# EAGLE design ultra-violet-tooth-sensor-mk-3.2 (EAGLE 6.5.0)
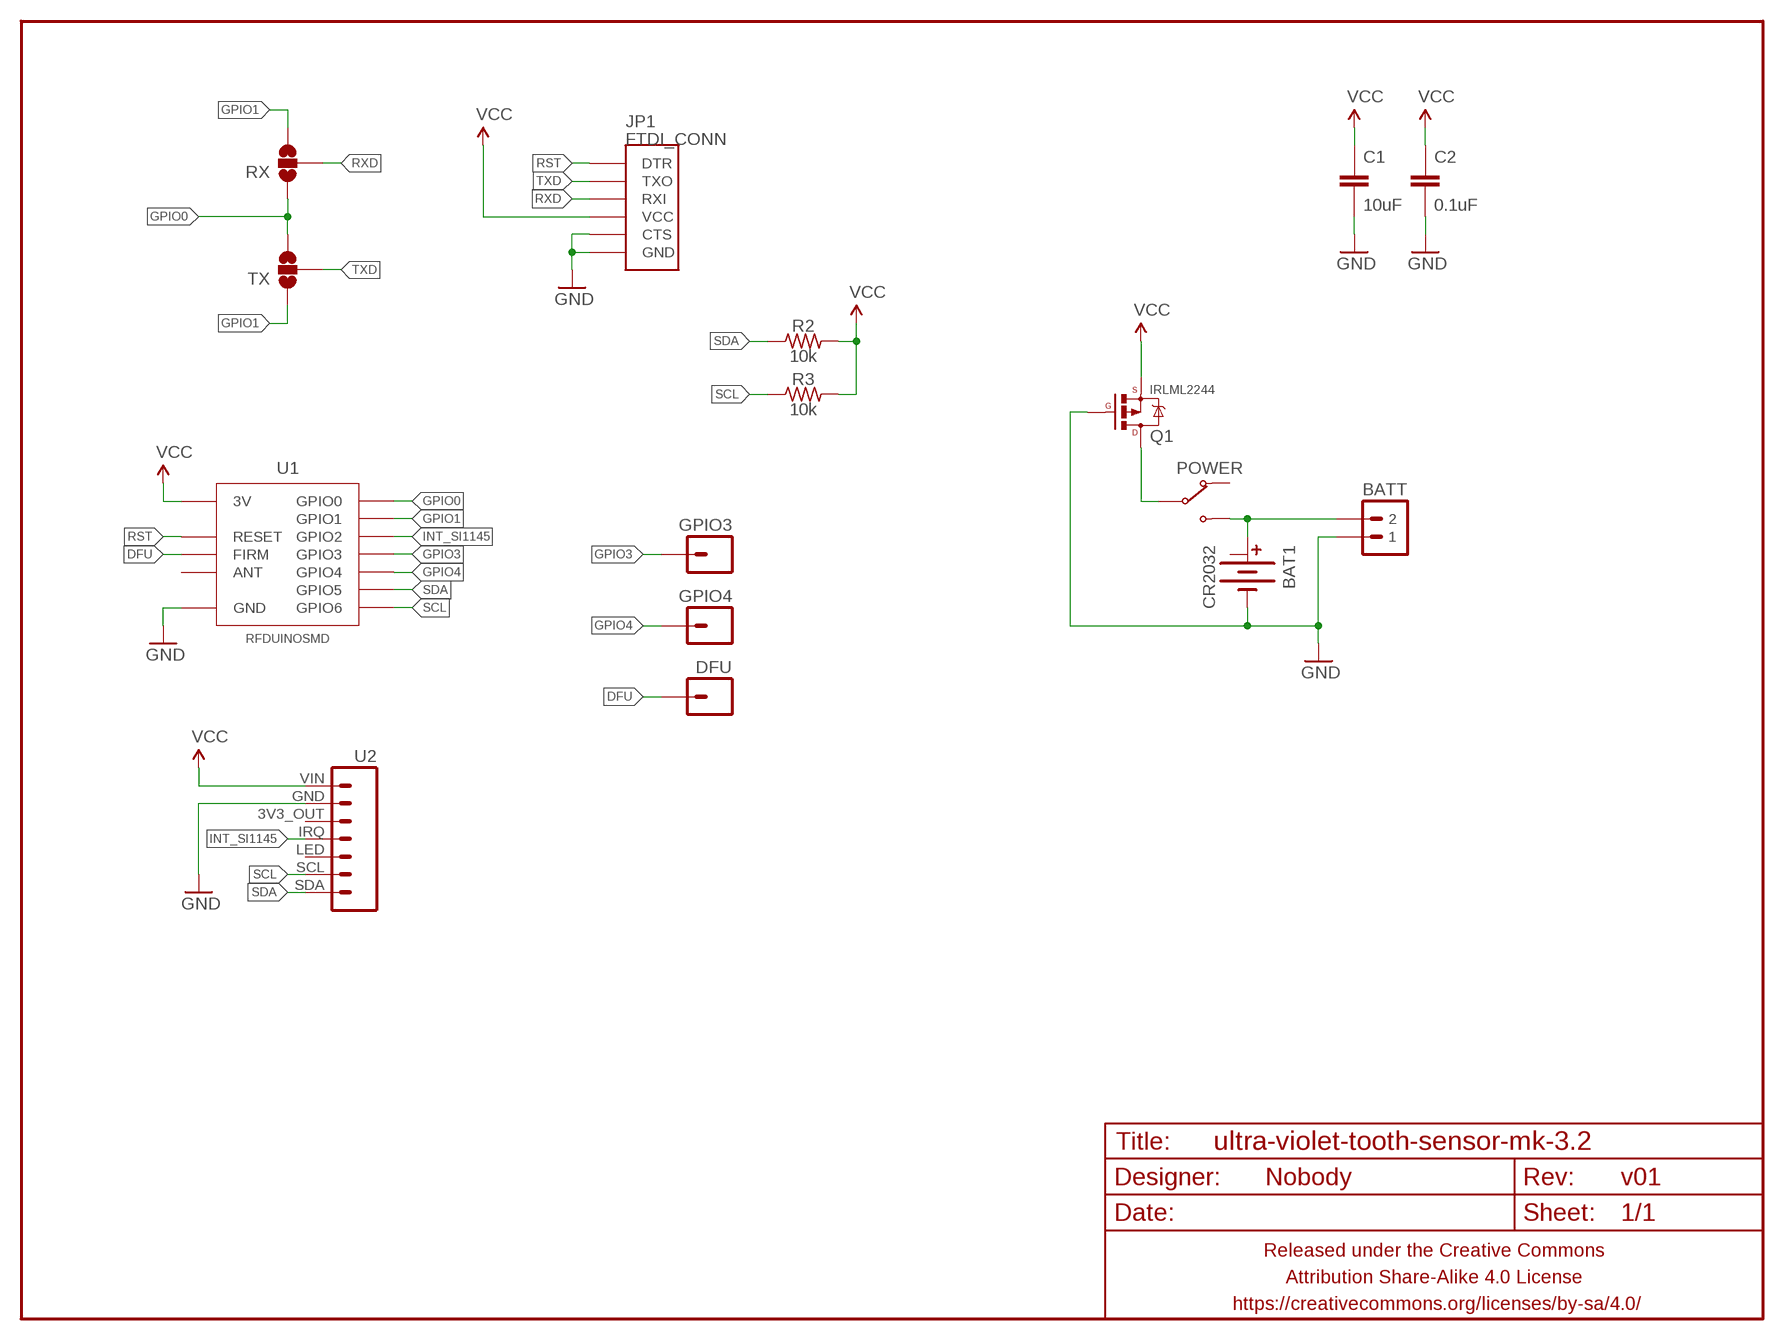
[diagram p0: schematic, sheet 1]

## Parts
BAT1  CR2032  BATTERY-COINCR2032_SMD_TIGHT  [BATTCON_20MM_MINE_STAHPIT]
BATT  M02PTH-CENTERED-R+  [1X02-CENTER-R+]
C1  10uF  CAPACITOR-CERAMICC1206  [C1206]
C2  0.1uF  CAPACITOR-CERAMICC0805  [C0805]
DFU  M01SMD_1.5X2MM  [1X01_1.5X2MM]
FRAME1  FRAME-LETTERNO_PACKAGE  [DUMMY]
GPIO3  M01SMD_1.5X2MM  [1X01_1.5X2MM]
GPIO4  M01SMD_1.5X2MM  [1X01_1.5X2MM]
JP1  FTDI_CONN  [FTDI_CONN]
POWER  SWITCH-SPDTPTH-RA-2.54MM  [SPDT-RA-2.54MM]
Q1  IRLML2244  MOSFET-PCHANNELIRLML2244  [SOT23-3]
R2  10k  RESISTORR0805  [R0805]
R3  10k  RESISTORR0805  [R0805]
RX  JUMPER-PAD-3-NOFULL_BOX_SILK  [PAD-JUMPER-3-NO_YES_SILK_FULL_BOX]
TX  JUMPER-PAD-3-NOFULL_BOX_SILK  [PAD-JUMPER-3-NO_YES_SILK_FULL_BOX]
U1  RFDUINOSMD  [RFDUINO-SMD]
U2  ADAFRUIT-SI1145-BREAKOUTNOHOLEY  [ADAFRUIT-SI1145-BREAKOUT-NOHOLES]

## Nets
DFU: DFU.P$1 U1.FACTORY(FIRM)
GND: BAT1.BOTTOM(-) BATT.1 C1.2 C2.2 JP1.CTS JP1.GND Q1.1(G) U1.GND@1(GND) U1.GND@2(GND) U1.GND@3(GND) U1.GND@4(GND) U1.GND@5(GND) U1.GND@6(GND) U1.GND@7(GND) U1.GND@8(GND) U2.GND
GPIO0: RX.1 TX.3 U1.GPIO0
GPIO1: RX.3 TX.1 U1.GPIO1
GPIO3: GPIO3.P$1 U1.GPIO3
GPIO4: GPIO4.P$1 U1.GPIO4
INT_SI1145: U1.GPIO2 U2.IRQ
N$1: BAT1.TOP@1(+) BATT.2 POWER.3(NO)
N$2: POWER.2(COM) Q1.3(D)
RST: JP1.DTR U1.RESET
RXD: JP1.RXI RX.2
SCL: R3.1 U1.GPIO6 U2.SCL
SDA: R2.1 U1.GPIO5 U2.SDA
TXD: JP1.TXO TX.2
VCC: C1.1 C2.1 JP1.VCC Q1.2(S) R2.2 R3.2 U1.3V U2.VIN
Unconnected: BAT1.TOP@2(+1) POWER.1(NC) U1.ANT U2.3V3_OUT U2.LED

## Library data of the parts
BAT1 = A_butts:BATTERY-COIN
BATT = A_butts:M02: Standard 2-pin 0.1" header. Use with - straight break away headers ( PRT-00116) - right angle break away headers (PRT-00553) - swiss pins (PRT-00743) - machine pins (PRT-00117) - female headers (PRT-00115) Molex polarized connector foot print use with: PRT-08233 with associated crimp pins and housings. 2.54_SCREWTERM for use with PRT-10571. 3.5mm Screw Terminal footprints for PRT-08084 5mm Screw Terminal footprints for use with PRT-08433
C1 C2 = A_butts:CAPACITOR-CERAMIC: CAPACITOR, European symbol
DFU GPIO3 GPIO4 = A_butts:M01: Header 1 Standard 1-pin 0.1" header. Use with straight break away headers (SKU : PRT-00116), right angle break away headers (PRT-00553), swiss pins (PRT-00743), machine pins (PRT-00117), and female headers (PRT-00115).
FRAME1 = A_butts:FRAME-LETTER: Schematic Frame Standard 8.5x11 US Letter frame; DESIGNER: Nobody; VERSION: v01
JP1 = A_butts:FTDI_CONN: Connector which mates to FTDI basic or FTDI cable.
POWER = A_butts:SWITCH-SPDT
Q1 = A_butts:MOSFET-PCHANNEL: Generic PMOSFET IRLML2244 - TRANS-11153 (SOT-23 -20V -4.3A) (1.Gate 2.Source 3.Drain) FQP27P06 - COM-10349 <http://www.sparkfun.com/products/10349> (TO-220 -60V -27A) (1.Gate 2.Source 3.Drain); PROD_ID: TRANS-11153
R2 R3 = A_butts:RESISTOR: RESISTOR, American symbol
RX TX = A_butts:JUMPER-PAD-3-NO
U1 = A_butts:RFDUINO
U2 = A_butts:ADAFRUIT-SI1145-BREAKOUT

## Board
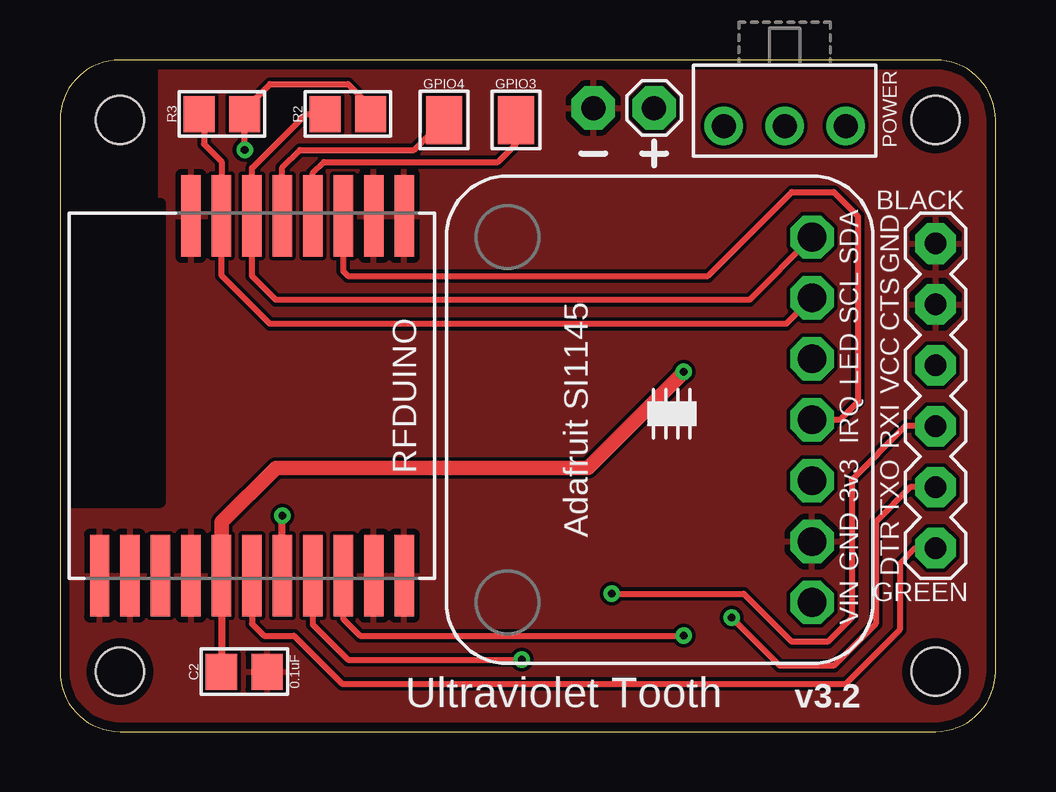
[diagram p1: board, top side]
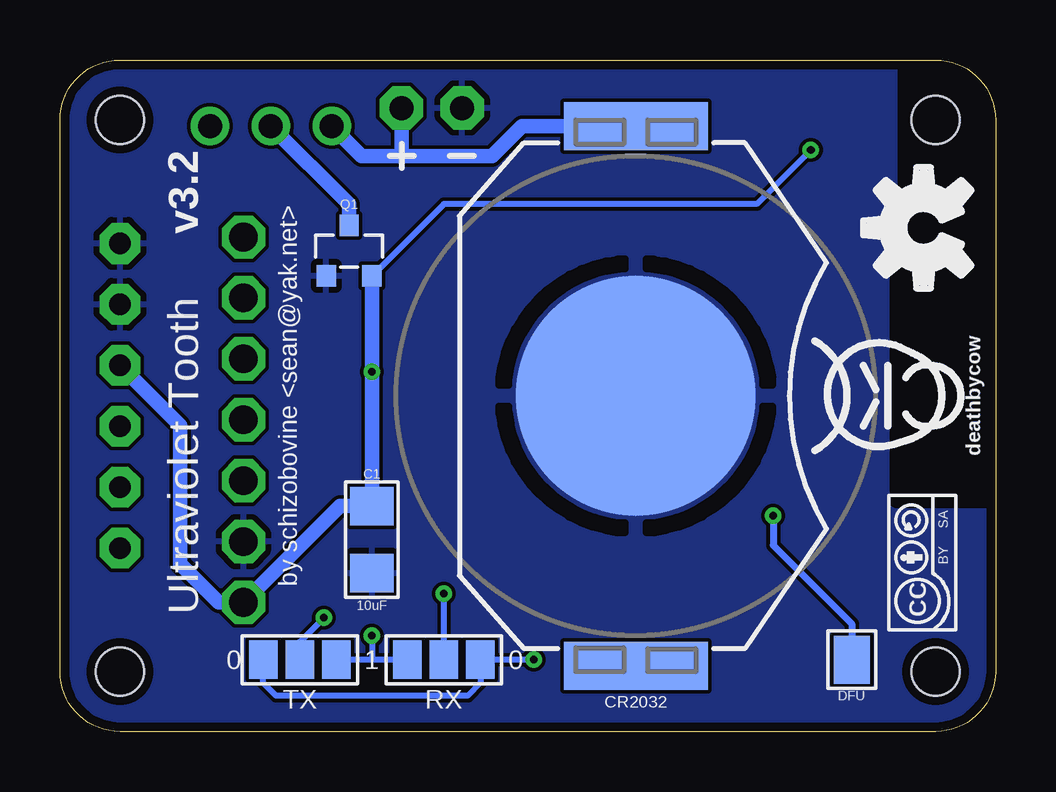
[diagram p2: board, bottom side, seen from below]

Size 39 x 28 mm. Coordinates in mm from the lower left corner, seen from the top.
Outline: 0,25.5 0,2.5 arc90 2.5,0 36.5,0 arc90 39,2.5 39,25.5 arc90 36.5,28 2.5,28 arc90 0,25.5
Copper layers (1*16): Top 0.0356mm / dielectric 1.5011mm / Bottom 0.0356mm
Design rules "LaenPCBOrder_2": minimum track width 6mil, minimum drill 13mil, track to track 6mil, track to pad 6mil, pad to pad 6mil, via to via 6mil, smd to smd 6mil, copper to edge 15mil, drill to drill 6mil, minimum pad ring 7mil, minimum via ring 7mil, stop-mask expansion 3mil, vias tented up to drill 20mil, thermal gap 10mil
Holes 2 mm at 2.5,25.5 2.5,2.5 36.5,25.5 36.5,2.5

### Footprints (pad centres in the part's own frame; a part is rotated, then mirrored left to right if it is on the bottom)
BATTCON_20MM_MINE_STAHPIT = smd 10 x 10: BOTTOM 0,0 | smd 6 x 2: TOP@1 0,11.25; TOP@2 0,-11.25
1X02-CENTER-R+ = drill 1 pad 1.8 octagon: 1 -1.27,0; 2 1.27,0
C1206 = smd 1.6 x 1.8: 1 -1.4,0; 2 1.4,0
C0805 = smd 1.3 x 1.5: 1 -0.95,0; 2 0.95,0
1X01_1.5X2MM = smd 1.5 x 2: P$1 0,0
FTDI_CONN = drill 0.9 pad 1.7 octagon: CTS 3.81,0; DTR -6.35,0; GND 6.35,0; RXI -1.27,0; TXO -3.81,0; VCC 1.27,0
SPDT-RA-2.54MM = drill 1 pad 1.6: 1 0,0; 2 2.54,0; 3 5.08,0
SOT23-3 = smd 0.8 x 0.9: 1 -0.95,-1; 2 0.95,-1; 3 0,1.1
R0805 = smd 1.3 x 1.5: 1 -0.95,0; 2 0.95,0
PAD-JUMPER-3-NO_YES_SILK_FULL_BOX = smd 1.2 x 1.6: 1 -1.524,0; 2 0,0; 3 1.524,0
RFDUINO-SMD = smd 3.4 x 0.8: 3V 7.5,-1.27; ANT 7.5,-3.81; FACTORY 7.5,1.27; GND@1 -7.5,6.35; GND@2 -7.5,5.08; GND@3 -7.5,-2.54; GND@4 7.5,-6.35; GND@5 7.5,-5.08; GND@6 7.5,-2.54; GND@7 7.5,5.08; GND@8 7.5,6.35; GPIO0 7.5,2.54; GPIO1 7.5,3.81; GPIO2 -7.5,3.81; GPIO3 -7.5,2.54; GPIO4 -7.5,1.27; GPIO5 -7.5,0; GPIO6 -7.5,-1.27; RESET 7.5,0
ADAFRUIT-SI1145-BREAKOUT-NOHOLES = drill 1.2 pad 1.8 octagon: 3V3_OUT -2.54,-6.35; GND -5.08,-6.35; IRQ 0,-6.35; LED 2.54,-6.35; SCL 5.08,-6.35; SDA 7.62,-6.35; VIN -7.62,-6.35

### Placement (x,y rotation side)
BAT1  15,14 0 bottom
BATT  23.5,26 0 top
C1  26,8 270 bottom
C2  7.68,2.5 0 top
DFU  6,3 180 bottom
FRAME1  0,0 180 top
GPIO3  19,25.5 0 top
GPIO4  16,25.5 0 top
JP1  36.5,14 90 top
POWER  32.75,25.25 180 top
Q1  26.95,20 0 bottom
R2  12,25.75 0 top
R3  6.75,25.75 0 top
RX  23,3 180 bottom
TX  29,3 180 bottom
U1  8,14 270 top
U2  25,13 90 top
U$1  [CC-BY-SA-4.0-NO-URL]  3.05,7.05 90 bottom
U$2  [COW_SMALL]  5,14 90 bottom
U$6  [OSHWLOGO_SILKONLY]  3,21 90 bottom

### Tracks (layer width: path | path; a pad name or v marks a point on that pad's centre or on a via)
DFU  (via drill 0.33)
  Top 0.3: U1.FACTORY v9.27,9
  Bottom 0.3: v9.27,9 9.27,7.77 6,4.5 DFU.P$1
GND
  pour Top (isolate 0.152, rank 6): 39.1,28.1 39.1,-0.1 -0.1,-0.1 -0.1,9.5 4.15,9.5 4.15,28.1
  pour Bottom (isolate 0.152, rank 6): 39.1,28.1 39.1,-0.1 -0.1,-0.1 -0.1,9.5 4.15,9.5 4.15,28.1
GPIO0  (via drill 0.33)
  Top 0.25: U1.GPIO0 10.54,4.46 12,3 v19.25,3
  Bottom 0.25: v19.25,3 RX.1 21.48,2.02 22,1.5 30,1.5 30.52,2.02 TX.3
GPIO1  (via drill 0.33)
  Top 0.25: U1.GPIO1 11.81,4.69 12.5,4 v26,4
  Bottom 0.25: 27.48,3.02 TX.1 26,3 | RX.3 26,3 | v26,4 26,3
GPIO3
  Top 0.25: U1.GPIO3 10.54,23.29 11,23.75 18.25,23.75 19,24.5 GPIO3.P$1
GPIO4
  Top 0.25: U1.GPIO4 9.27,23.52 10,24.25 14.75,24.25 GPIO4.P$1
INT_SI1145
  Top 0.25: U1.GPIO2 11.81,19.19 12,19 27,19 30.5,22.5 32.25,22.5 33.25,21.5 33.25,13.75 32.5,13 U2.IRQ
N$1
  Bottom 0.6: BAT1.TOP@1 19.75,25.25 21,24 24.77,24 | 24.77,24 26.42,24 POWER.3 | BATT.2 24.77,24
N$2
  Bottom 0.6: Q1.3 26.95,21.99 POWER.2
RST
  Top 0.25: U1.RESET 8,4.5 8.5,4 9.75,4 11.75,2 32.75,2 35,4.25 35,7 35.65,7.65 JP1.DTR
RXD  (via drill 0.33)
  Top 0.25: JP1.RXI 35.23,12.73 33,10.5 33,4.75 32,3.75 30.5,3.75 28.5,5.75 v23,5.75
  Bottom 0.25: RX.2 v23,5.75
SCL
  Top 0.25: 6,25.45 6,24.5 6.73,23.77 U1.GPIO6 6.73,19.02 8.75,17 30.27,17 U2.SCL
  Top 0.3: R3.1 6,25.45
SDA
  Top 0.25: R2.1 10.25,25.75 8,23.5 U1.GPIO5 8,19 9,18 28.73,18 U2.SDA
TXD  (via drill 0.33)
  Top 0.25: JP1.TXO 35.44,10.19 34,8.75 34,4.5 32.25,2.75 30,2.75 v28,4.75
  Bottom 0.25: TX.2 29,3.75 v28,4.75
VCC  (via drill 0.33)
  Top 0.25: R2.2 13,25.55 13,26 12,27 8.75,27 7.7,25.95 R3.2 v7.7,24.25
  Top 0.3: U1.3V C2.1
  Top 0.6: U1.3V 6.73,8.73 9,11 22,11 v26,15
  Bottom 0.25: v7.7,24.25 9.95,22 23,22 Q1.2
  Bottom 0.6: JP1.VCC 34,12.77 34,7 32.38,5.38 U2.VIN 27.33,9.4 C1.1 v26,15 Q1.2

### Text on the board
tPlace: Ultraviolet Tooth
bPlace: by schizobovine <sean@yak.net> | Ultraviolet Tooth | 0 | 1 | 0